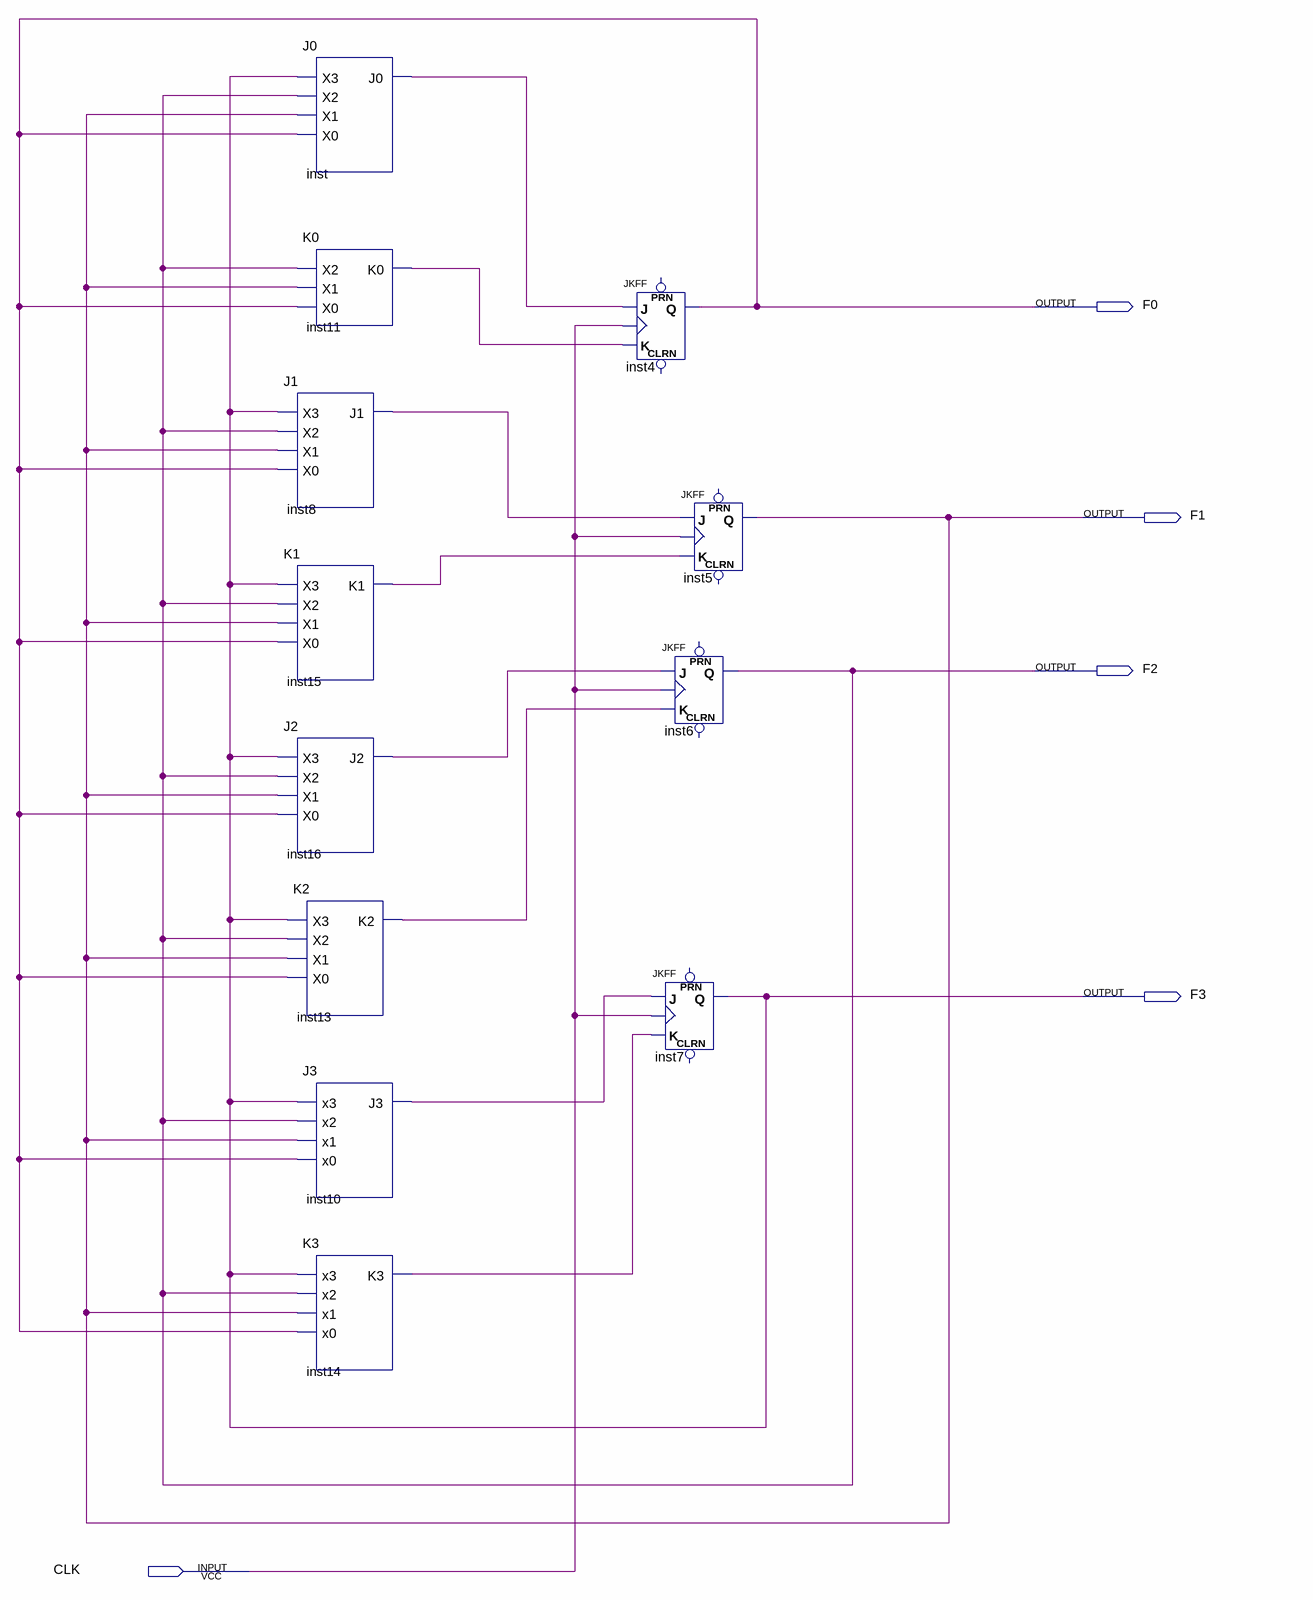
[diagram p0: schematic sheet]
// Quartus schematic MACHINE.bdf as structural Verilog: 12 symbols, 5 pins
module MACHINE (
  input  CLK,
  output F0,
  output F1,
  output F2,
  output F3
);

  wire inst8_j1, inst10_j3, inst11_k0, inst13_k2, inst14_k3, inst15_k1, inst16_j2, inst_j0;

  J0 inst (.X3(F3), .X2(F2), .X1(F1), .X0(F0), .J0(inst_j0));
  K0 inst11 (.X2(F2), .X1(F1), .X0(F0), .K0(inst11_k0));
  J1 inst8 (.X3(F3), .X2(F2), .X1(F1), .X0(F0), .J1(inst8_j1));
  K1 inst15 (.X3(F3), .X2(F2), .X1(F1), .X0(F0), .K1(inst15_k1));
  J2 inst16 (.X3(F3), .X2(F2), .X1(F1), .X0(F0), .J2(inst16_j2));
  K2 inst13 (.X3(F3), .X2(F2), .X1(F1), .X0(F0), .K2(inst13_k2));
  J3 inst10 (.x3(F3), .x2(F2), .x1(F1), .x0(F0), .J3(inst10_j3));
  K3 inst14 (.x3(F3), .x2(F2), .x1(F1), .x0(F0), .K3(inst14_k3));
  JKFF inst4 (.K(inst11_k0), .J(inst_j0), .CLK(CLK), .Q(F0));  // open: PRN, CLRN
  JKFF inst5 (.K(inst15_k1), .J(inst8_j1), .CLK(CLK), .Q(F1));  // open: PRN, CLRN
  JKFF inst6 (.K(inst13_k2), .J(inst16_j2), .CLK(CLK), .Q(F2));  // open: PRN, CLRN
  JKFF inst7 (.K(inst14_k3), .J(inst10_j3), .CLK(CLK), .Q(F3));  // open: PRN, CLRN
endmodule
